# Altium schematic sheet 3V3_MCU.SchDoc
size 420 x 297 mm; SheetNumber: 5; SheetTotal: 21
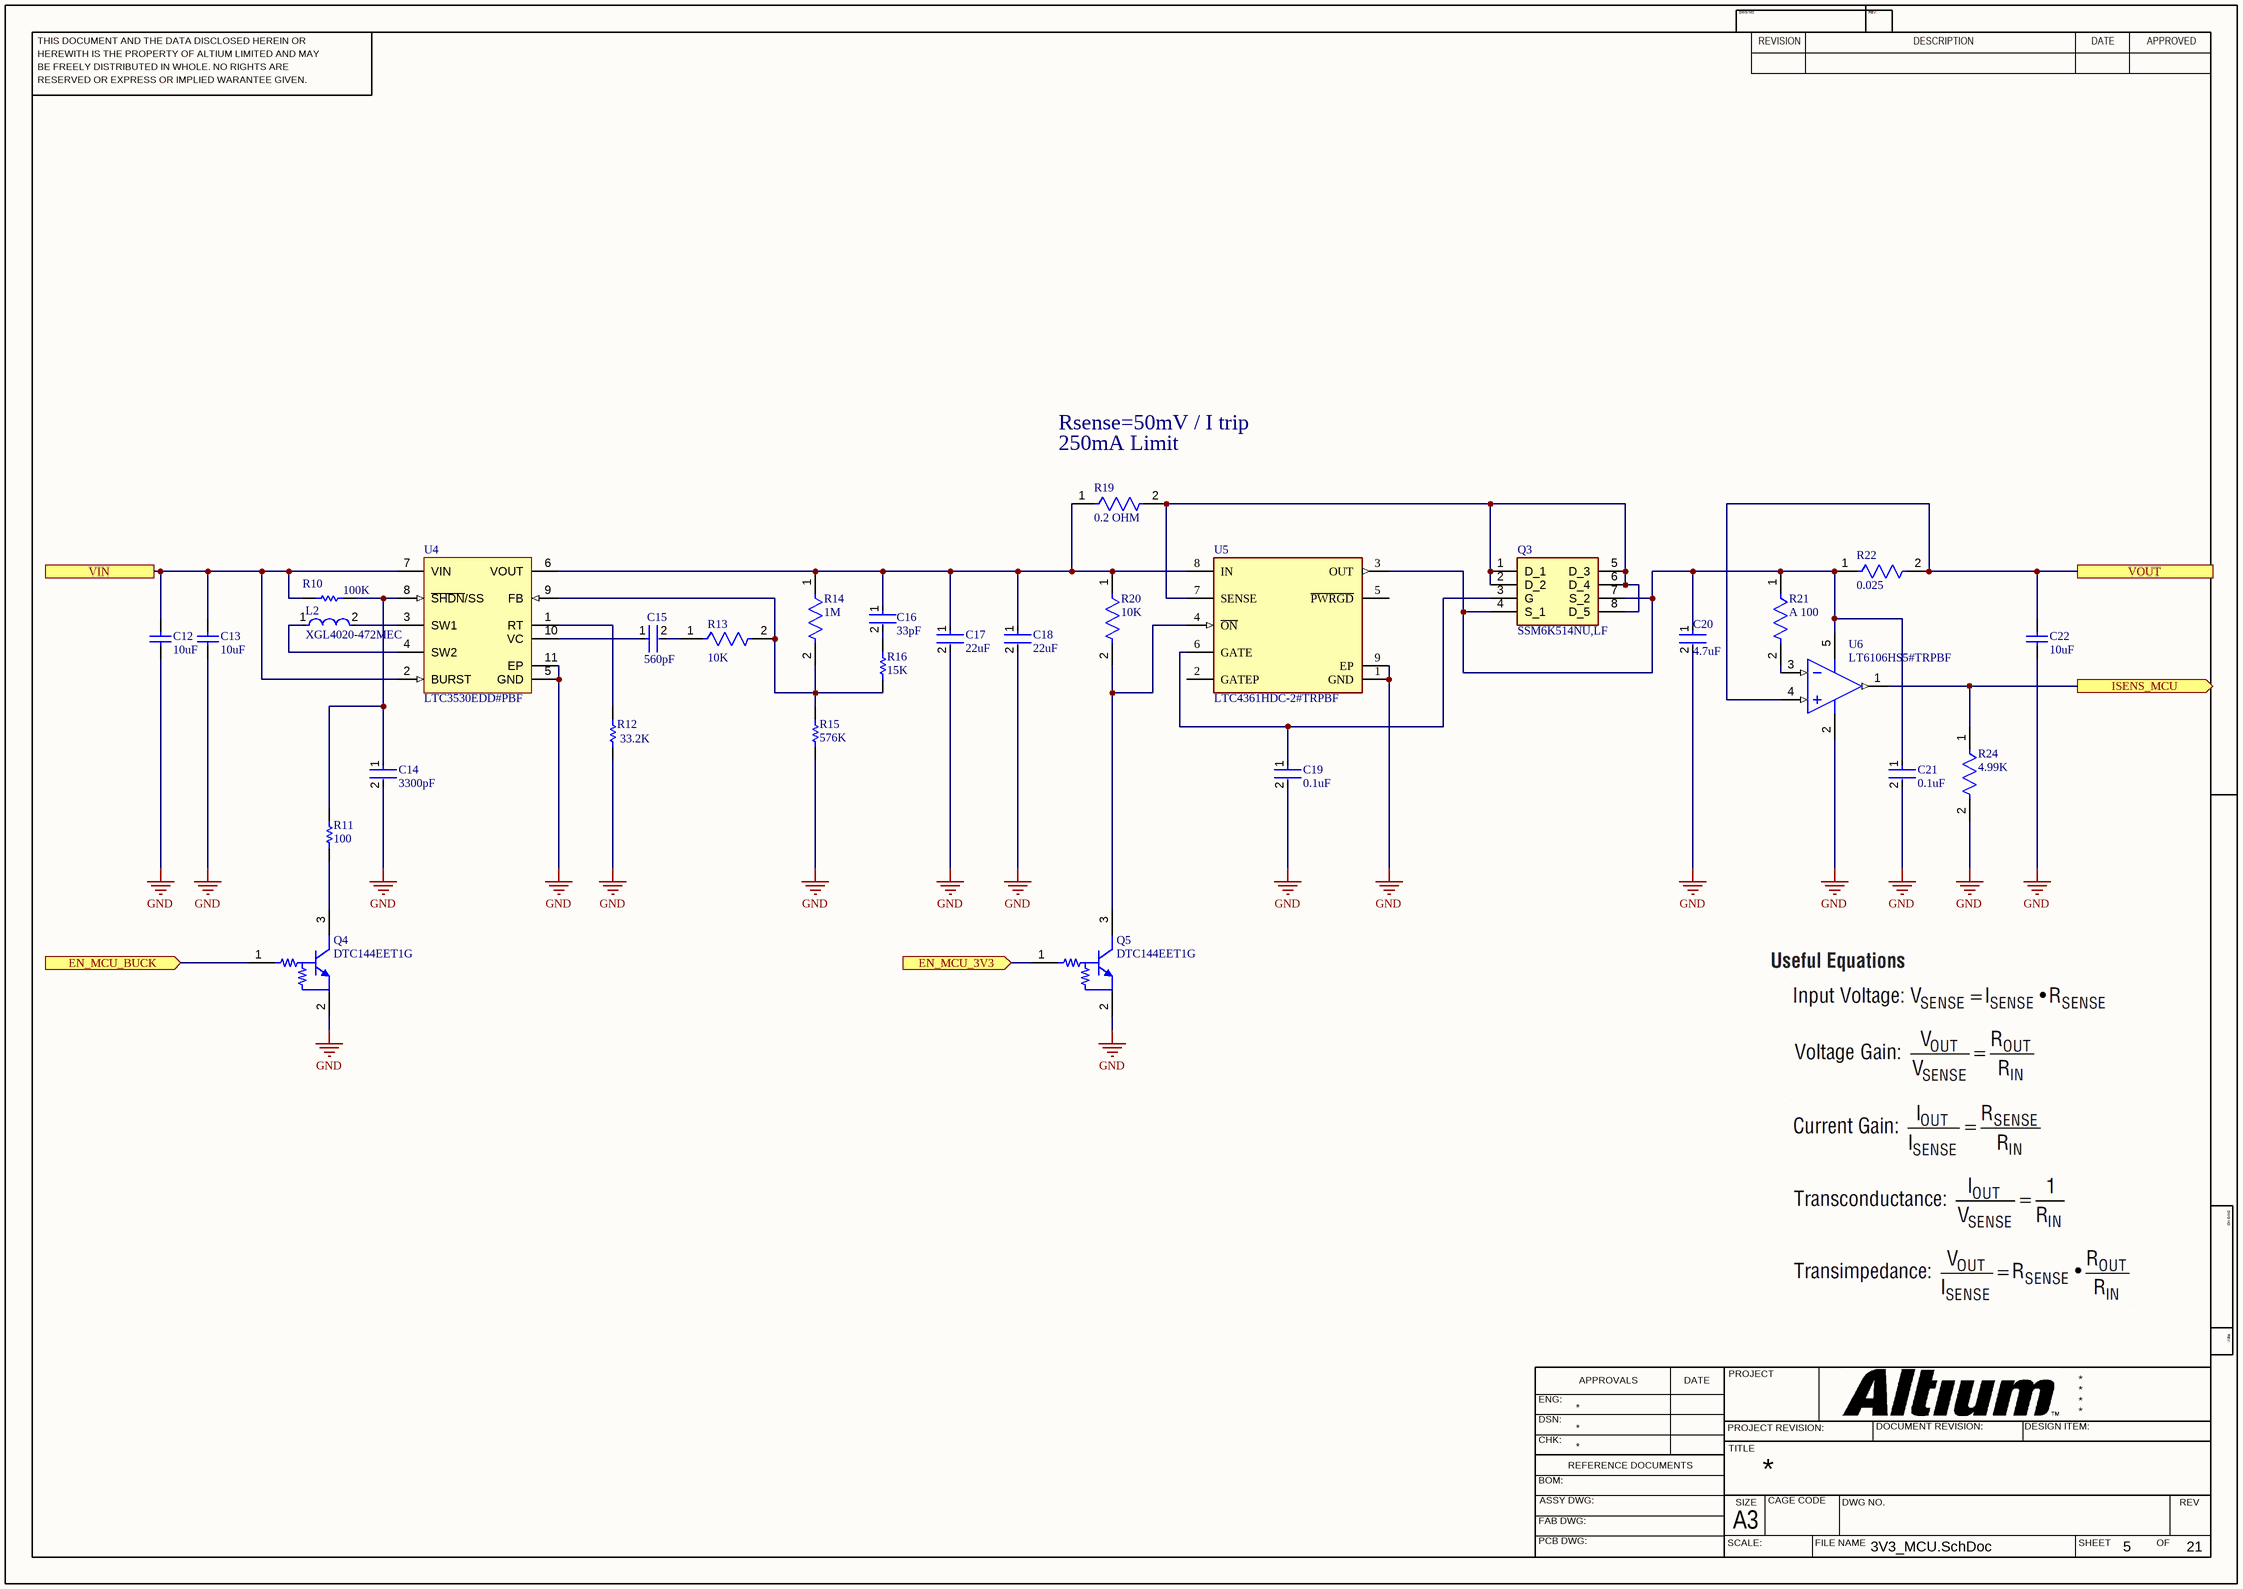
[diagram p0: 3V3_MCU.SchDoc]

## Parts
C12  10uF  [CAPC2013X140X45NL15T25]
C13  10uF  [CAPC2013X140X45NL15T25]
C14  3300pF  [FP-C0603C-CF-MFG]
C15  560pF  [FP-C0603C-CF-MFG]
C16  33pF  [FP-C0603C-CF-MFG]
C17  22uF  [FP-GRM21B-0_2-e0_2_0_7-IPC_C]
C18  22uF  [FP-GRM21B-0_2-e0_2_0_7-IPC_C]
C19  0.1uF  [FP-C0603C-CF-MFG]
C20  4.7uF  [FP-GRM188-0_15-IPC_A]
C21  0.1uF  [FP-C0603C-CF-MFG]
C22  10uF  [CAPC2013X140X45NL15T25]
L2  XGL4020-472MEC  [FP-XGL4020-MFG]
Q3  SSM6K514NU,LF  [UDFN6B]
Q4  DTC144EET1G  [ONSC-SC-75-3-463-01_V]
Q5  DTC144EET1G  [ONSC-SC-75-3-463-01_V]
R10  100K  [RESC1608X55X30ML20T10]
R11  100  [RESC1608X55X30LL20T10]
R12  33.2K  [RESC1608X55X30NL15T15]
R13  10K  [FP-RK73B1J-MFG]
R14  1M  [FP-ERJ3EK-IPC_C]
R15  576K  [RESC1608X55X30LL15T15]
R16  15K  [RESC1608X55X30NL20T10]
R19  0.2 OHM  [FP-CSR0603-IPC_A]
R20  10K  [FP-RK73B1J-MFG]
R21  A 100  [FP-ERA3A-IPC_B]
R22  0.025  [FP-PRL0816-MFG]
R24  4.99K  [FP-ERA3A-IPC_C]
U4  LTC3530EDD#PBF  [LT-DD-10_V]
U5  LTC4361HDC-2#TRPBF  [FP-DC8-8-05-08-1719-IPC_C]
U6  LT6106HS5#TRPBF  [LT-S5-5-TSOT-23_M]

## Ports
EN_MCU_3V3 (in), EN_MCU_BUCK (in), ISENS_MCU (out), VIN, VOUT

## Nets
GND: C12.1 C13.1 C14.2 C17.2 C18.2 C19.2 C20.2 C21.2 C22.1 Q4.2(E) Q5.2(E) R12.1 R15.1 R24.2 U4.5(GND) U4.11(EP) U5.1(GND) U5.9(EP) U6.2(V-)
EN_MCU_3V3: Q5.1(B) ; port EN_MCU_3V3
EN_MCU_BUCK: Q4.1(B) ; port EN_MCU_BUCK
ISENS_MCU: R24.1 U6.1(OUT) ; port ISENS_MCU
VIN: C12.2 C13.2 R10.2 U4.2(BURST) U4.7(VIN) ; port VIN
VOUT: C22.2 R22.2 U6.4(+IN) ; port VOUT
NetC14_1: C14.1 R10.1 R11.2 U4.8(~{SHDN}/SS)
NetC15_1: C15.1 U4.10(VC)
NetC15_2: C15.2 R13.1
NetC16_1: C16.1 C17.1 C18.1 R14.1 R19.1 R20.1 U4.6(VOUT) U5.8(IN)
NetC16_2: C16.2 R16.2
NetC19_1: C19.1 Q3.3(G) U5.6(GATE)
NetC20_1: C20.1 C21.1 Q3.4(S_1) Q3.7(S_2) R21.1 R22.1 U5.3(OUT) U6.5(V+)
NetL2_1: L2.1 U4.4(SW2)
NetL2_2: L2.2 U4.3(SW1)
NetQ3_1: Q3.1(D_1) Q3.2(D_2) Q3.5(D_3) Q3.6(D_4) Q3.8(D_5) R19.2 U5.7(SENSE)
NetQ4_3: Q4.3(C) R11.1
NetQ5_3: Q5.3(C) R20.2 U5.4(~{ON})
NetR12_2: R12.2 U4.1(RT)
NetR13_2: R13.2 R14.2 R15.2 R16.1 U4.9(FB)
NetR21_2: R21.2 U6.3(-IN)

Not connected (* = marked no-connect by the designer): U5 2(GATEP) 5(~{PWRGD})

## Notes on the sheet
- (near R19) 250mA Limit
- Rsense=50mV / I trip
- THIS DOCUMENT AND THE DATA DISCLOSED HEREIN OR
- HEREWITH IS THE PROPERTY OF ALTIUM LIMITED AND MAY
- DWG NO:
- REVISION
- REV:
- DESCRIPTION
- DATE
- APPROVED
- BE FREELY DISTRIBUTED IN WHOLE. NO RIGHTS ARE
- RESERVED OR EXPRESS OR IMPLIED WARANTEE GIVEN.
- ENG:
- APPROVALS
- PROJECT
- DSN:
- CHK:
- REFERENCE DOCUMENTS
- PROJECT REVISION:
- TITLE
- DOCUMENT REVISION:
- DESIGN ITEM:
- BOM:
- FAB DWG:
- PCB DWG:
- ASSY DWG:
- SCALE:
- A3
- SIZE
- CAGE CODE
- FILE NAME
- DWG NO.
- SHEET
- OF
- REV

## Library data of the parts
C12 C13 C22 = CMP-2007-03395-1: Part Number: GRM21BR71A106KE51L; Manufacturer: Murata
C14 = CMP-2006-03174-2: CAP CER 3300PF 50V 5% X7R 0603; Manufacturer Part Number: C0603C332J5RACTU; Manufacturer: KEMET; Automotive Grade: Grade 1; Material: Ceramic; Value: 3,300 pF; Temperature Coefficient: 30ppm/°C; Tolerance: 0.05; Temperature Range Low: -55°C; Device Class L3: Ceramic Capacitors; Temperature Characteristic: X7R; Temperature: -55°C to +125°C; Device Class L1: Passive Components; ComponentLink2URL: https://api.kemet.com/component-edge/download/datasheet/C0603C100J5GACAUTO.pdf; Automotive: Yes; Capacitance: 3,300 pF; RoHS: TRUE; Mouser Description: Multilayer Ceramic Capacitors MLCC - SMD/SMT 50volts 3300pF X7R 5%; Height: 0.87mm; Temperature Range High: +125°C; ComponentLink2Description: Datasheet; Voltage Rating: 50 V; Octopart: https://octopart.com/c0603c332j5ractu-kemet-9139905; Package: C0603C-CF; Lead Free: Yes; Device Class L2: Capacitors; Digikey Description: CAP CER 3300PF 50V 5% X7R 0603; Category: Cap
C15 = CMP-2006-03245-2: CAP CER 560PF 50V X7R 0603; Manufacturer Part Number: C0603C561K5RACTU; Manufacturer: KEMET; Tolerance: 0.1; Material: Ceramic; Automotive Grade: Grade 1; Temperature Coefficient: 30ppm/°C; Temperature Range High: +125°C; Category: Cap; Voltage Rating: 50 V; Lead Free: Yes; RoHS: TRUE; Octopart: https://octopart.com/c0603c561k5ractu-kemet-138569; Device Class L3: Ceramic Capacitors; Temperature: -55°C to +125°C; Automotive: Yes; Device Class L1: Passive Components; Mouser Description: C0603C 560pF Ceramic Multilayer Capacitor, 50 VDC, +125degC, X7R Dielec, +/-10%; Capacitance: 560 pF; Temperature Characteristic: X7R; ComponentLink2URL: https://api.kemet.com/component-edge/download/datasheet/C0603C100J5GACAUTO.pdf; Temperature Range Low: -55°C; Digikey Description: CAP CER 560PF 50V X7R 0603; Device Class L2: Capacitors; ComponentLink2Description: Datasheet; Package: C0603C-CF; Value: 560 pF; Height: 0.87mm
C16 = CMP-03020-019617-1: CAP CER 33PF 16V X7R 0603; Manufacturer Part Number: C0603C330K4RAC7867; Manufacturer: KEMET; Material: Ceramic; Temperature Coefficient: 30ppm/°C; Automotive Grade: Grade 1; Tolerance: 0.1; Capacitance: 33 pF; ComponentLink2Description: Datasheet; ComponentLink2URL: https://api.kemet.com/component-edge/download/datasheet/C0603C100J5GACAUTO.pdf; Height: 0.87mm; Octopart: https://octopart.com/c0603c330k4rac7867-kemet-83501964; Temperature Characteristic: X7R; Temperature: -55°C to +125°C; RoHS: TRUE; Device Class L3: Ceramic Capacitors; Device Class L1: Passive Components; Digikey Description: CAP CER 33PF 16V X7R 0603; Lead Free: Yes; Temperature Range High: +125°C; Voltage Rating: 16 V; Package: C0603C-CF; Category: Cap; Automotive: Yes; Temperature Range Low: -55°C; Device Class L2: Capacitors; Value: 33 pF
C17 C18 = CMP-06035-025845-1: Chip Multilayer Ceramic Capacitors for General Purpose, 0805, 22uF, X7T, +22%/-33%, 20%, 10V; Dissipation Factor: 0.035%; Height: 1.25mm; Min Operating Temperature: -55°C; Case/Package: 0805; Packaging: Tape and Reel; Voltage: 10V; Depth: 1.25mm; Width: 1.25mm; Voltage Rating: 10V; Dielectric: X7T; Weight: 0.000335oz; Capacitance: 22uF; Mount: Surface Mount; Package Quantity: 3000; Lead Free: Lead Free; Tolerance: 20%; Thickness: 0.057inch; Max Operating Temperature: 125°C; Length: 2mm; Material: Ceramic; Case Code (Metric): 2012; Termination: SMD/SMT; Voltage Rating (DC): 10V; Dielectric Material: Ceramic; Case Code (Imperial): 0805
C19 = CMP-2006-03054-2: CAP CER 0.1UF 16V X7R 0603; Manufacturer: KEMET; Manufacturer Part Number: C0603C104J4RACTU; Material: Ceramic; Capacitance: 0.10 μF; Tolerance: 0.05; Automotive Grade: Grade 1; Value: 0.10 μF; Temperature Coefficient: 30ppm/°C; Digikey Description: CAP CER 0.1UF 16V X7R 0603; Automotive: Yes; Octopart: https://octopart.com/c0603c104j4ractu-kemet-102515; Device Class L2: Capacitors; Temperature Characteristic: X7R; Category: Cap; Mouser Description: Cap Ceramic 0.1uF 16V X7R 5% SMD 0603 125°C Paper T/R; Voltage Rating: 16 V; Temperature Range Low: -55°C; Device Class L1: Passive Components; ComponentLink2URL: https://api.kemet.com/component-edge/download/datasheet/C0603C100J5GACAUTO.pdf; Lead Free: Yes; Temperature Range High: +125°C; Height: 0.87mm; Device Class L3: Ceramic Capacitors; ComponentLink2Description: Datasheet; Package: C0603C-CF; RoHS: TRUE; Temperature: -55°C to +125°C
C20 = CMP-06035-000034-2: CAP CER 4.7UF 10V X7S 0603; Material: Ceramic; Tolerance: 10%; Height: 0.8mm; Termination: SMD/SMT; Case Code (Metric): 1608; Voltage Rating: 10V; Width: 0.8mm; Resistor Type: Ceramic; Length: 1.6mm; Voltage Rating (DC): 10V; Weight: 0.000222oz; Dielectric: X7S; Package Quantity: 4000; Mount: Surface Mount; Case Code (Imperial): 0603; Case/Package: 0603; Packaging: Tape and Reel; Thickness: 0.037inch; Min Operating Temperature: -55°C; Capacitance: 4.7uF; Max Operating Temperature: 125°C
C21 = CMP-2006-03061-2: CAP CER 0.1UF 50V X7R 0603; Manufacturer: KEMET; Manufacturer Part Number: C0603C104K5RACTU; Tolerance: 0.1; Temperature Coefficient: 30ppm/°C; Material: Ceramic; Automotive Grade: Grade 1; Value: 0.10 μF; Temperature: -55°C to +125°C; RoHS: TRUE; Temperature Range High: +125°C; Lead Free: Yes; Octopart: https://octopart.com/c0603c104k5ractu-kemet-139244; Digikey Description: CAP CER 0.1UF 50V X7R 0603; Category: Cap; Package: C0603C-CF; ComponentLink2Description: Datasheet; Temperature Range Low: -55°C; Device Class L1: Passive Components; Voltage Rating: 50 V; Automotive: Yes; Device Class L3: Ceramic Capacitors; ComponentLink2URL: https://api.kemet.com/component-edge/download/datasheet/C0603C100J5GACAUTO.pdf; Capacitance: 0.10 μF; Device Class L2: Capacitors; Temperature Characteristic: X7R; Height: 0.87mm
L2 = CMP-11268-000013-1: Inductor, power, 4.7uH, SMT; Manufacturer: Coilcraft; Self Resonant Frequency: 23MHz; Saturation Current: 1.9A; Shielding: true; Test Frequency: 1MHz; Tolerance: 20%; Rms Current: 5.6A; Core Material: Composite; Series Resistance: 47.3mΩ; Automotive Grade: Grade 1; Standoff Height: 0.06mm; Inductance: 4.7uH; ComponentLink2Description: Datasheet; Value: 4.7uH; Automotive: Yes; RoHS: TRUE; Device Class L1: Passive Components; Category: Ind; Manufacturer Part Number: XGL4020-472MEC; ComponentLink2URL: https://www.coilcraft.com/pdfs/xgl4020.pdf; Ambient Temperature Range Low: -40°C; Height: 2.1mm; Octopart: https://octopart.com/xgl4020-472mec-coilcraft-99681031; Device Class L2: Inductors; Ambient Temperature Range High: +125°C; Package: XGL4020; Lead Free: Yes; Composition: Wirewound; Device Class L3: Fixed Inductors
Q3 = SSM6K514NU,LF: MOSFET (N-Channel); Manufacturer_Name: Toshiba; Datasheet Link: http://toshiba.semicon-storage.com/info/docget.jsp?did=29875&prodName=SSM6N7002CFU; Manufacturer_Part_Number: SSM6K514NU,LF; Mouser Part Number: 757-SSM6K514NULF; Mouser Price/Stock: https://www.mouser.co.uk/ProductDetail/Toshiba/SSM6K514NULF?qs=yfGysFjEcj13lHFOvblArQ%3D%3D; Arrow Part Number: SSM6K514NU,LF; Arrow Price/Stock: https://www.arrow.com/en/products/ssm6k514nulf/toshiba?region=nac
Q4 Q5 = CMP-0630-00198-1: Digital Transistor (BRT), R1=47 kOhm, R2=47 kOhm, NPN Transistor, 3-Pin SC-75, Pb-Free, Tape and Reel; Manufacturer: On Semiconductor; hFE Min: 80; R1/R2 Typ: 1; IC Continuous (A): 0.1; V(BR)CEO Min (V): 50; Mounting Technology: Surface Mount; PartNumber: DTC144EET1G; Polarity: NPN; PackageReference: SC-75-3-463-01; ComponentLink2URL: http://www.onsemi.cn/pub_link/Collateral/DTC144E-D.PDF; PackageVersion: Rev. F, 07/2005; ComponentLink3Description: Package Specification; ComponentLink1Description: Manufacturer URL; ComponentLink1URL: http://www.onsemi.com/; DatasheetVersion: Rev. 2; Packing: Tape and Reel; PackageDescription: 3-Pin Small Outline Transistor, Body 1.6 x 0.8 mm, Pitch 0.5 mm; ComponentLink2Description: Datasheet; RoHS: TRUE; ComponentLink3URL: http://www.onsemi.com/pub_link/Collateral/463-01.PDF
R10 = CMP-2000-01852-1: Part Number: RK73B1JTTD104J; Manufacturer: KOA Speer
R11 = CMP-2000-01849-1: Manufacturer: KOA Speer; Part Number: RK73B1JTTD101J
R12 = CMP-2000-00441-1: Part Number: ERJ-3EKF3322V; Manufacturer: Panasonic
R13 R20 = CMP-2000-01851-2: RES 10K OHM 5% 1/10W 0603; Temperature Coefficient: 200ppm/°C; Voltage Rating: 50V; Power Rating: 100mW; Resistance: 10kR; Length: 1.6mm; Lead Free: Lead Free; Resistance Tolerance: 5%; Case Code (Metric): 1608; Width: 0.8mm; Height: 0.45mm; Max Operating Temperature: 155°C; RoHS Compliant: Yes; Resistor Type: Thick Film; Min Operating Temperature: -55°C; Case Code (Imperial): 0603; Technology: THICK FILM; Package Quantity: 5000; Tolerance: 5%; Case/Package: 0603; Voltage Rating (DC): 50V; Depth: 0.8mm; Packaging: Tape and Reel; Number of Pins: 2; Construction: Rectangular; Series: RK73B; Military Standard: Not; Termination: SMD/SMT
R14 = CMP-1012-00849-3: RES SMD 1M OHM 1% 1/10W 0603; Resistance: 1MR; Voltage Rating: 75V; Temperature Coefficient: 100ppm/°C; Power Rating: 100mW; REACH SVHC: No SVHC; Radiation Hardening: No; Features: Automotive AEC-Q200; Case Code (Metric): 1608; Resistance Tolerance: 1%; Case/Package: 0603; Termination: SMD/SMT; Max Operating Temperature: 155°C; Tolerance: 1%; Size Code: 0603; Case Code (Imperial): 0603; Min Operating Temperature: -55°C; Number of Pins: 2; Mount: Surface Mount; Package Quantity: 1; Military Standard: Not; Voltage Rating (DC): 75V; Depth: 0.8mm; Packaging: Tape and Reel; Width: 0.8mm; Number of Terminations: 2; Length: 1.6mm; Height: 0.022inch; RoHS Compliant: Yes; Resistor Type: Thick Film; Contact Plating: Tin; Lead Free: Lead Free; Series: ERJ; Construction: Rectangular; Max Power Dissipation: 100mW
R15 = CMP-2000-00577-1: Part Number: ERJ-3EKF5763V; Manufacturer: Panasonic
R16 = CMP-2000-01876-1: Part Number: RK73B1JTTD153J; Manufacturer: KOA Speer
R19 = CMP-26527-003125-1: General Purpose Thick Film Chip Resistor, 0603, 0.2Ω, 1%, 300ppm/°C, 0.125W; Max Power Dissipation: 125mW; Resistance: 200mR; Resistor Type: Thick Film; Max Operating Temperature: 155°C; Radiation Hardening: No; Length: 0.063inch; Case Code (Metric): 1608; RoHS Compliant: Yes; Case Code (Imperial): 0603; Lead Free: Lead Free; Width: 0.031inch; Number of Terminations: 2; Series: CSR; Height: 0.022inch; Case/Package: 0603; Packaging: Tape and Reel; Mount: Surface Mount; Min Operating Temperature: -55°C; Temperature Coefficient: 300ppm/°C; Contact Plating: Tin; Tolerance: 1%
R21 = CMP-2000-00870-2: RES SMD 100 OHM 0.1% 1/10W 0603; Voltage Rating: 75V; Power Rating: 100mW; Resistance: 100R; Temperature Coefficient: 25ppm/°C; Number of Terminations: 2; Case/Package: 0603; Termination: SMD/SMT; Number of Pins: 2; Size Code: 0603; Length: 1.6mm; Min Operating Temperature: -55°C; Resistor Type: Thin Film; Depth: 0.8mm; Military Standard: Not; Packaging: Tape and Reel; RoHS Compliant: Yes; Construction: Rectangular; Resistance Tolerance: 0.1%; Contact Plating: Tin; Width: 0.8mm; Mount: Surface Mount; Case Code (Metric): 1608; Max Operating Temperature: 155°C; Height: 0.45mm; Case Code (Imperial): 0603; Series: ERA-3A; Package Quantity: 5000; REACH SVHC: No SVHC; Tolerance: 0.1%; Max Power Dissipation: 100mW; Radiation Hardening: No; Technology: METAL FILM
R22 = CMP-28537-000948-1: 25 mOhms ±1% 0.33W Chip Resistor Wide 0306 (0816 Metric), Current Sense Thin Film; Temperature Coefficient: 200ppm/°C; Resistance: 25mR; Power Rating: 330mW; Tolerance: 1%; Case Code (Metric): 0816; Packaging: Tape and Reel; RoHS Compliant: Yes; Height: 0.4mm; Termination: SMD/SMT; Case Code (Imperial): 0306; Technology: THIN FILM; Package Quantity: 1000; Length: 1.6mm; Width: 0.8mm; Series: PRL
R24 = CMP-2000-00077-5: RES SMD 4.99KOHM 0.1% 1/10W 0603; Voltage Rating (DC): 75V; Max Power Dissipation: 100mW; Temperature Coefficient: 25ppm/°C; Resistance: 4.99kR; Voltage Rating: 150V; Features: Automotive AEC-Q200; Depth: 0.8mm; Case Code (Imperial): 0603; Resistance Tolerance: 0.1%; Mount: Surface Mount; Contact Plating: Tin; Length: 1.6mm; RoHS Compliant: Yes; Termination: SMD/SMT; Width: 0.8mm; Case/Package: 0603; Series: ERA; Radiation Hardening: No; Tolerance: 0.1%; Lead Free: Lead Free; Technology: METAL FILM; Construction: Rectangular; Number of Terminations: 2; Weight: 7.1E-05oz; Power Rating: 100mW; Number of Pins: 2; Min Operating Temperature: -55°C; Height: 0.45mm; Case Code (Metric): 1608; Package Quantity: 5000; Military Standard: Not; Max Operating Temperature: 155°C; Resistor Type: Thin Film; Reach SVHC Compliant: Yes; Packaging: Tape and Reel
U4 = CMP-0492-00076-1: Wide Input Voltage Synchronous Buck-Boost DC/DC Converter, 10-pin SON (DD-10), -40 to 85 degC, Pb-Free; Manufacturer: Linear Technology; Frequency Adjust Range: 300kHz - 2MHz; Number of Outputs: 1; ComponentLink1URL: http://www.linear.com/; RoHS: TRUE; ComponentLink2URL: http://cds.linear.com/docs/en/datasheet/3530fb.pdf; ComponentLink3URL: http://cds.linear.com/docs/en/packaging/DFN_10_05-08-1699.pdf; PackageDescription: 10-Pin Plastic DFN, Body 3 x 3 mm, Pitch 0.5 mm; PackageReference: DD-10; ComponentLink1Description: Manufacturer URL; PackageVersion: Rev. C, 06/2010; Mounting Technology: Surface Mount; ComponentLink3Description: Package Specification; ComponentLink2Description: Datasheet; PartNumber: LTC3530EDD#PBF; DatasheetVersion: Rev. B; Code_JEDEC: MO-229
U5 = CMP-0474-00015-2: IC OVP/OCP PROTECTION CTLR 8DFN; Number of Circuits: 1; RoHS Compliant: Yes; Packaging: Tape and Reel; Case/Package: DFN; Number of Pins: 8; Package Quantity: 2500
U6 = CMP-0359-01984-2: Single Channel, Low Cost, High Side Current Sense Operational Amplifier, 0.2 MHz Typical GBW, 5-Pin SOT-23 (S5-5), High Temperature / Automotive, Pb-Free, Reel; Manufacturer: Linear Technology; Linear Technology Part Number: LT6106; Vos (mV) Typical: 0.15; Vs Min (V): 2.7; Vs Max (V): 36; Is (mA) Typical: 0.06; Vos (mV) Guaranteed: 0.25; Channels (#): 1; GBW (MHz) Typical: 0.2; PackageDescription: 5-Lead Plastic TSOT-23, Body 1.63 x 2.90 mm, Pitch 0.95 mm; ComponentLink3Description: Package Specification; Mounting Technology: Surface Mount; Type: CSA; RevisionNote: URLs updated; ComponentLink2URL: http://cds.linear.com/docs/en/datasheet/6106fa.pdf; ComponentLink1URL: http://www.linear.com/; Code_JEDEC: MO-193; PartNumber: LT6106HS5#TRPBF; Packing: Reel; DatasheetVersion: Rev. A; RoHS: Pb-Free; ComponentLink3URL: http://cds.linear.com/docs/en/packaging/SOT_5_05-08-1635.pdf; ComponentLink1Description: Manufacturer URL; PackageReference: LT-S5-5-TSOT-23; ComponentLink2Description: Datasheet